# Altium schematic sheet PT_Sensor.SchDoc
size A4
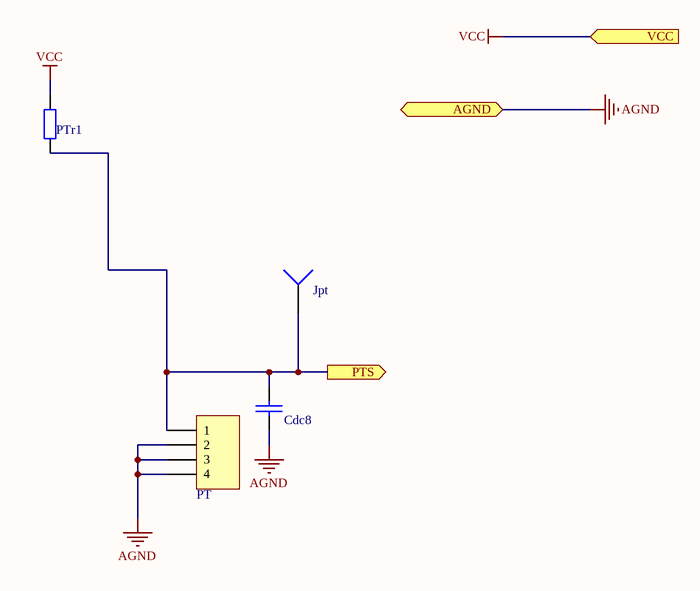
[diagram p0: PT_Sensor.SchDoc]

## Parts
Cdc8  47nF  [ECE-CAPC2012-0805SM]  (value not drawn)
Jpt  TEST PIN  [ECE-HDR1TH]  (value not drawn)
PT  4 Way  [ECE-600104STTH]  (value not drawn)
PTr1  39K  [ECE-RESC1608-0603SM]  (value not drawn)

## Ports
AGND (bidir), PTS (out), VCC (in)

## Nets
AGND: Cdc8.2 PT.2 PT.3 PT.4 ; port AGND
VCC: PTr1.2 ; port VCC
PTS: Cdc8.1 Jpt.1 PT.1 PTr1.1 ; port PTS

## Library data of the parts
Cdc8 = CAP000522: CAP CER 47nF 50V X7R SM0805; Manufactuer: Samsung; Manufacturer-PN: CL21B473KBCNNNC; Assembly Method: Surface Mount; Item Type: Item; Path: ece/ts/Lists/Stock Inventory; Value: 47nF; UoA Stock#: CAP000522; Size/Package: 0805 (2012 Metric); Voltage/Current: 50V; Supplier1: Digikey; Supplier1-PN: 1276-1250-2-ND; Component Type: CAP-0805-47nF; Category: Capacitor; Status: Active
Jpt = CON000017: Value: 1 way; Assembly Method: Through hole; Item Type: Item; Path: ece/ts/Lists/Stock Inventory; UoA Stock#: CON000017; Component Type: NA; Category: Connector; Status: Active
PT = CON000003: HEADER POLARISED 4WAY TH; Manufactuer: GTK; Manufacturer-PN: 600104ST; Assembly Method: Through hole; Item Type: Item; Path: ece/ts/Lists/Stock Inventory; UoA Stock#: CON000003; Value: 4 Way; Size/Package: 2.54 Radial; Datasheet Link: http://share.engineering.auckland.ac.nz/ece/ts/Student%20Documents/polarised_connectors.pdf; Supplier1: Elecon; Supplier1-PN: YY3N04; Supplier2: Active Components; Supplier2-PN: 600104ST; Component Type: NA; Category: Connector; Status: Active
PTr1 = RES000157: RES CER 39K 1608 SM; Manufactuer: Yageo; Manufacturer-PN: RC0603FR-0739KL; Assembly Method: Surface Mount; Voltage/Current: 1/10W; Item Type: Item; Path: ece/ts/Lists/Stock Inventory; Value: 39K; UoA Stock#: RES000157; Size/Package: 1608 (0603); Supplier1: Digikey; Supplier1-PN: 311-39.0KHRTR-ND; Component Type: RES-1608-39K; Category: Resistor; Status: Active; Datasheet Link: http://share.engineering.auckland.ac.nz/ece/ts/Student%20Documents/Yageo-Resistors.pdf